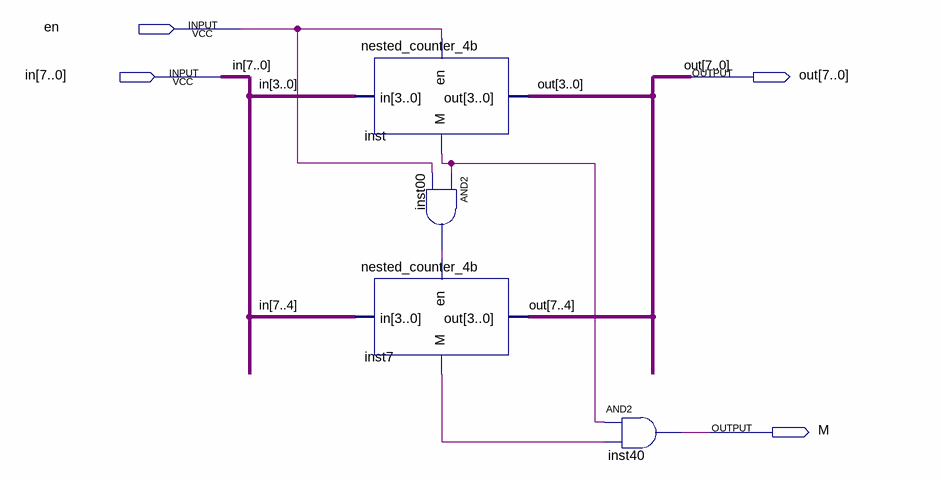
[diagram p0: schematic sheet]
// Quartus schematic nested_counter_8b.bdf as structural Verilog: 4 symbols, 4 pins
module nested_counter_8b (
  input  en,
  input  [7:0] in,
  output [7:0] out,
  output M
);

  wire inst00_out, inst7_m, inst_m;

  nested_counter_4b inst (.en(en), .in(in[3:0]), .out(out[3:0]), .M(inst_m));
  and inst00 (inst00_out, inst_m, en);
  nested_counter_4b inst7 (.en(inst00_out), .in(in[7:4]), .out(out[7:4]), .M(inst7_m));
  and inst40 (M, inst_m, inst7_m);
endmodule
